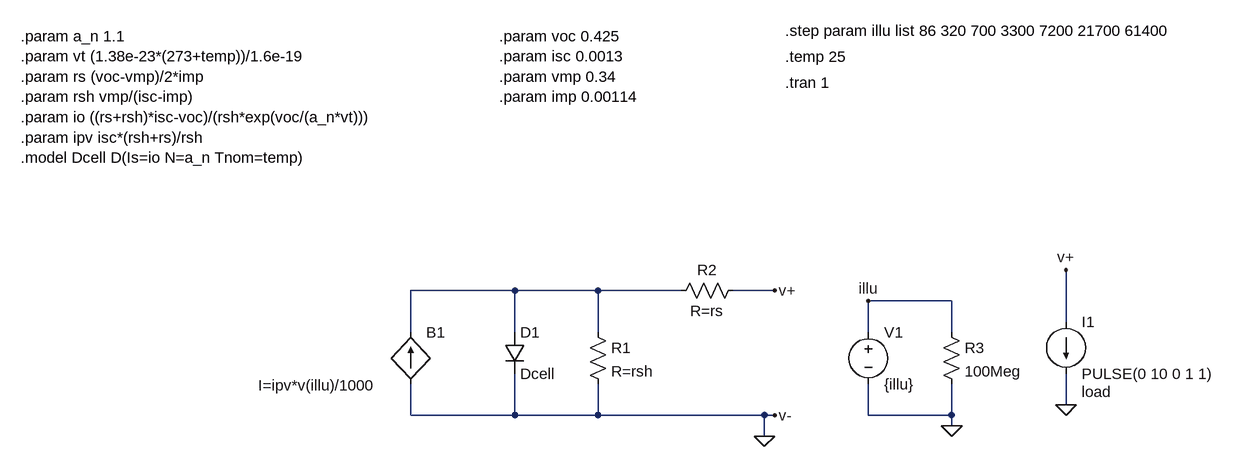
[diagram p0: schematic SDM1.asc]
SDM1.asc, the LTspice schematic file:
Version 4
SHEET 1 1436 680
WIRE 336 48 176 48
WIRE 464 48 336 48
WIRE 592 48 464 48
WIRE 736 48 672 48
WIRE 1008 64 880 64
WIRE 1184 96 1184 16
WIRE 176 112 176 48
WIRE 336 112 336 48
WIRE 464 112 464 48
WIRE 880 112 880 64
WIRE 1008 112 1008 64
WIRE 1184 224 1184 176
WIRE 176 240 176 192
WIRE 336 240 336 176
WIRE 336 240 176 240
WIRE 464 240 464 192
WIRE 464 240 336 240
WIRE 720 240 464 240
WIRE 736 240 720 240
WIRE 880 240 880 192
WIRE 1008 240 1008 192
WIRE 1008 240 880 240
WIRE 1008 256 1008 240
WIRE 720 272 720 240
FLAG 736 48 v+
FLAG 736 240 v-
FLAG 720 272 0
FLAG 1008 256 0
FLAG 880 64 illu
FLAG 1184 224 0
FLAG 1184 16 v+
SYMBOL bi2 176 112 R0
WINDOW 3 -235 82 Left 2
SYMATTR Value I=ipv*v(illu)/1000
SYMATTR InstName B1
SYMBOL diode 320 112 R0
SYMATTR InstName D1
SYMATTR Value Dcell
SYMBOL res 448 96 R0
SYMATTR InstName R1
SYMATTR Value R=rsh
SYMBOL res 688 32 R90
WINDOW 0 0 56 VBottom 2
WINDOW 3 32 56 VTop 2
SYMATTR InstName R2
SYMATTR Value R=rs
SYMBOL res 992 96 R0
SYMATTR InstName R3
SYMATTR Value 100Meg
SYMBOL voltage 880 96 R0
WINDOW 123 0 0 Left 0
WINDOW 39 0 0 Left 0
SYMATTR InstName V1
SYMATTR Value {illu}
SYMBOL current 1184 96 R0
WINDOW 123 0 0 Left 0
WINDOW 39 24 108 Left 2
SYMATTR SpiceLine load
SYMATTR InstName I1
SYMATTR Value PULSE(0 10 0 1 1)
TEXT 752 -272 Left 2 !.tran 1
TEXT 752 -352 Left 2 !.step param illu list 86 320 700 3300 7200 21700 61400
TEXT 752 -312 Left 2 !.temp 25
TEXT -424 -344 Left 2 !.param a_n 1.1\n.param vt (1.38e-23*(273+temp))/1.6e-19\n.param rs (voc-vmp)/2*imp\n.param rsh vmp/(isc-imp)\n.param io ((rs+rsh)*isc-voc)/(rsh*exp(voc/(a_n*vt)))\n.param ipv isc*(rsh+rs)/rsh\n.model Dcell D(Is=io N=a_n Tnom=temp)
TEXT 312 -344 Left 2 !.param voc 0.425\n.param isc 0.0013\n.param vmp 0.34\n.param imp 0.00114

The netlist it stands for:
* SDM1.asc
B1 0 N001 I=ipv*v(illu)/1000
D1 N001 0 Dcell
R1 N001 0 R=rsh
R2 v+ N001 R=rs
R3 illu 0 100Meg
V1 illu 0 {illu}
I1 v+ 0 PULSE(0 10 0 1 1) load
.model D D
.lib standard.dio
.tran 1
.step param illu list 86 320 700 3300 7200 21700 61400
.temp 25
.param a_n 1.1
.param vt (1.38e-23*(273+temp))/1.6e-19
.param rs (voc-vmp)/2*imp
.param rsh vmp/(isc-imp)
.param io ((rs+rsh)*isc-voc)/(rsh*exp(voc/(a_n*vt)))
.param ipv isc*(rsh+rs)/rsh
.model Dcell D(Is=io N=a_n Tnom=temp)
.param voc 0.425
.param isc 0.0013
.param vmp 0.34
.param imp 0.00114
.backanno
.end